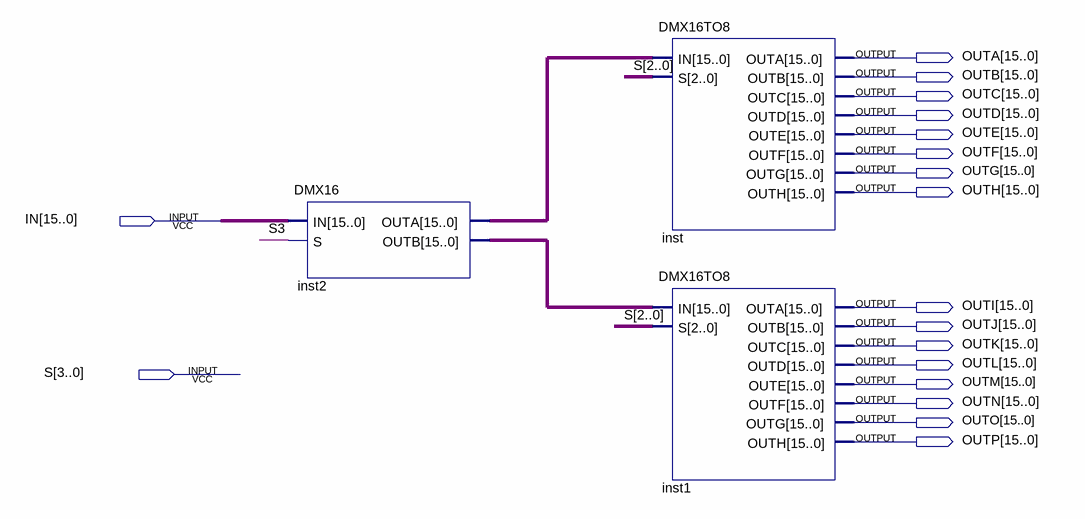
[diagram p0: schematic sheet]
// Quartus schematic DMX16TO16.bdf as structural Verilog: 3 symbols, 18 pins
module DMX16TO16 (
  input  [15:0] IN,
  input  [3:0] S,
  output [15:0] OUTA,
  output [15:0] OUTB,
  output [15:0] OUTC,
  output [15:0] OUTD,
  output [15:0] OUTE,
  output [15:0] OUTF,
  output [15:0] OUTG,
  output [15:0] OUTH,
  output [15:0] OUTI,
  output [15:0] OUTJ,
  output [15:0] OUTK,
  output [15:0] OUTL,
  output [15:0] OUTM,
  output [15:0] OUTN,
  output [15:0] OUTO,
  output [15:0] OUTP
);

  wire [15:0] inst2_outa, inst2_outb;

  DMX16 inst2 (.IN(IN), .S(S[3]), .OUTA(inst2_outa), .OUTB(inst2_outb));
  DMX16TO8 inst (
    .IN(inst2_outa), .S(S[2:0]), .OUTA(OUTA), .OUTB(OUTB), .OUTC(OUTC), .OUTD(OUTD), .OUTE(OUTE),
    .OUTF(OUTF), .OUTG(OUTG), .OUTH(OUTH));
  DMX16TO8 inst1 (
    .IN(inst2_outb), .S(S[2:0]), .OUTA(OUTI), .OUTB(OUTJ), .OUTC(OUTK), .OUTD(OUTL), .OUTE(OUTM),
    .OUTF(OUTN), .OUTG(OUTO), .OUTH(OUTP));
endmodule
